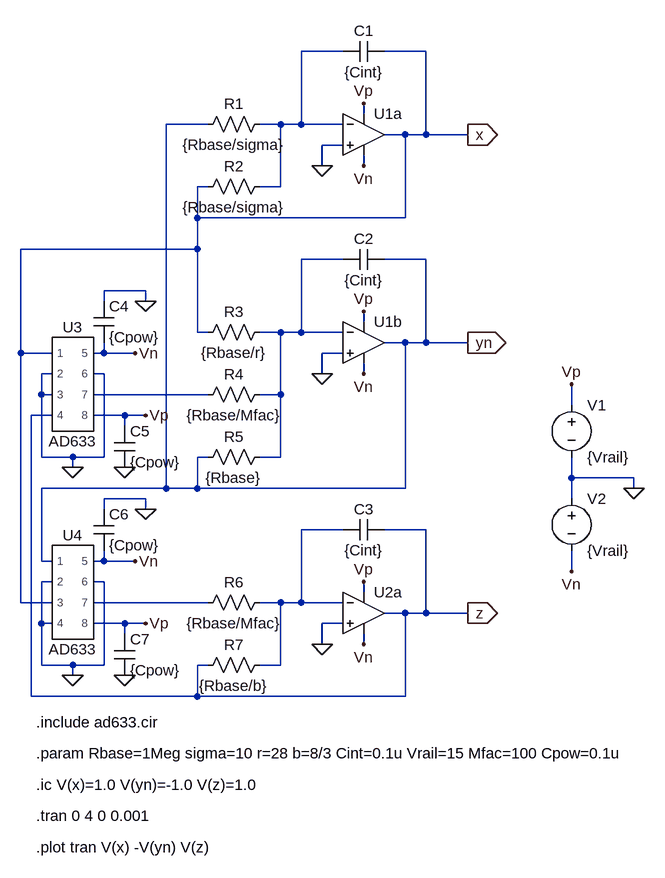
[diagram p0: schematic schematic.asc]
schematic.asc, the LTspice schematic file:
Version 4
SHEET 1 944 1600
WIRE 288 -48 224 -48
WIRE 416 -48 352 -48
WIRE 320 48 320 32
WIRE 80 64 16 64
WIRE 192 64 160 64
WIRE 224 64 224 -48
WIRE 224 64 192 64
WIRE 288 64 224 64
WIRE 384 80 352 80
WIRE 416 80 416 -48
WIRE 416 80 384 80
WIRE 480 80 416 80
WIRE 288 96 256 96
WIRE 256 128 256 96
WIRE 320 128 320 112
WIRE 80 160 64 160
WIRE 192 160 192 64
WIRE 192 160 160 160
WIRE 64 208 64 160
WIRE 384 208 384 80
WIRE 384 208 64 208
WIRE 64 256 64 208
WIRE 64 256 -208 256
WIRE 288 272 224 272
WIRE 416 272 352 272
WIRE -16 320 -80 320
WIRE -80 336 -80 320
WIRE -16 336 -16 320
WIRE 320 368 320 352
WIRE 64 384 64 256
WIRE 80 384 64 384
WIRE 192 384 160 384
WIRE 224 384 224 272
WIRE 224 384 192 384
WIRE 288 384 224 384
WIRE 384 400 352 400
WIRE 416 400 416 272
WIRE 416 400 384 400
WIRE 480 400 416 400
WIRE -208 416 -208 256
WIRE -160 416 -208 416
WIRE -80 416 -80 400
WIRE -80 416 -96 416
WIRE -32 416 -80 416
WIRE 288 416 256 416
WIRE -160 448 -176 448
WIRE -80 448 -96 448
WIRE 256 448 256 416
WIRE 320 448 320 432
WIRE -176 480 -176 448
WIRE -160 480 -176 480
WIRE 80 480 -96 480
WIRE 192 480 192 384
WIRE 192 480 160 480
WIRE 640 496 640 464
WIRE -160 512 -192 512
WIRE -48 512 -96 512
WIRE -16 512 -48 512
WIRE -48 528 -48 512
WIRE -176 576 -176 480
WIRE -128 576 -176 576
WIRE -80 576 -80 448
WIRE -80 576 -128 576
WIRE 80 576 64 576
WIRE 192 576 192 480
WIRE 192 576 160 576
WIRE -128 592 -128 576
WIRE 640 608 640 576
WIRE 736 608 640 608
WIRE 16 624 16 64
WIRE 16 624 -176 624
WIRE 64 624 64 576
WIRE 64 624 16 624
WIRE 384 624 384 400
WIRE 384 624 64 624
WIRE 736 624 736 608
WIRE -16 640 -80 640
WIRE 640 640 640 608
WIRE -80 656 -80 640
WIRE -16 656 -16 640
WIRE 288 688 224 688
WIRE 416 688 352 688
WIRE -176 736 -176 624
WIRE -160 736 -176 736
WIRE -80 736 -80 720
WIRE -80 736 -96 736
WIRE -32 736 -80 736
WIRE 640 752 640 720
WIRE -160 768 -176 768
WIRE -80 768 -96 768
WIRE 320 784 320 768
WIRE -208 800 -208 416
WIRE -160 800 -208 800
WIRE 80 800 -96 800
WIRE 192 800 160 800
WIRE 224 800 224 688
WIRE 224 800 192 800
WIRE 288 800 224 800
WIRE 384 816 352 816
WIRE 416 816 416 688
WIRE 416 816 384 816
WIRE 480 816 416 816
WIRE -176 832 -176 768
WIRE -160 832 -176 832
WIRE -48 832 -96 832
WIRE -16 832 -48 832
WIRE 288 832 256 832
WIRE -48 848 -48 832
WIRE 256 864 256 832
WIRE 320 864 320 848
WIRE -176 896 -176 832
WIRE -128 896 -176 896
WIRE -80 896 -80 768
WIRE -80 896 -128 896
WIRE 80 896 64 896
WIRE 192 896 192 800
WIRE 192 896 160 896
WIRE -128 912 -128 896
WIRE -192 944 -192 512
WIRE 64 944 64 896
WIRE 64 944 -192 944
WIRE 384 944 384 816
WIRE 384 944 64 944
FLAG 736 624 0
FLAG 640 464 Vp
FLAG 640 752 Vn
FLAG 320 32 Vp
FLAG 320 352 Vp
FLAG 320 768 Vp
FLAG 320 864 Vn
FLAG 320 448 Vn
FLAG 320 128 Vn
FLAG 256 448 0
FLAG 256 128 0
FLAG 256 864 0
FLAG 480 80 x
IOPIN 480 80 Out
FLAG 480 400 yn
IOPIN 480 400 Out
FLAG -128 592 0
FLAG -32 416 Vn
FLAG -16 512 Vp
FLAG -128 912 0
FLAG -32 736 Vn
FLAG -16 832 Vp
FLAG 480 816 z
IOPIN 480 816 Out
FLAG -16 656 0
FLAG -48 912 0
FLAG -48 592 0
FLAG -16 336 0
SYMBOL OpAmps/UniversalOpAmp 320 80 R0
SYMATTR InstName U1a
SYMBOL OpAmps/UniversalOpAmp 320 400 R0
SYMATTR InstName U1b
SYMBOL OpAmps/UniversalOpAmp 320 816 R0
SYMATTR InstName U2a
SYMBOL Cap 352 -64 R90
WINDOW 0 0 32 VBottom 2
WINDOW 3 32 32 VTop 2
SYMATTR InstName C1
SYMATTR Value {Cint}
SYMBOL Cap 352 256 R90
WINDOW 0 0 32 VBottom 2
WINDOW 3 32 32 VTop 2
SYMATTR InstName C2
SYMATTR Value {Cint}
SYMBOL Cap 352 672 R90
WINDOW 0 0 32 VBottom 2
WINDOW 3 32 32 VTop 2
SYMATTR InstName C3
SYMATTR Value {Cint}
SYMBOL voltage 640 480 R0
SYMATTR InstName V1
SYMATTR Value {Vrail}
SYMBOL voltage 640 624 R0
SYMATTR InstName V2
SYMATTR Value {Vrail}
SYMBOL Res 176 48 R90
WINDOW 0 0 56 VBottom 2
WINDOW 3 32 56 VTop 2
SYMATTR InstName R1
SYMATTR Value {Rbase/sigma}
SYMBOL Res 176 144 R90
WINDOW 0 0 56 VBottom 2
WINDOW 3 32 56 VTop 2
SYMATTR InstName R2
SYMATTR Value {Rbase/sigma}
SYMBOL Res 176 368 R90
WINDOW 0 0 56 VBottom 2
WINDOW 3 32 56 VTop 2
SYMATTR InstName R3
SYMATTR Value {Rbase/r}
SYMBOL Res 176 464 R90
WINDOW 0 0 56 VBottom 2
WINDOW 3 32 56 VTop 2
SYMATTR InstName R4
SYMATTR Value {Rbase/Mfac}
SYMBOL Res 176 560 R90
WINDOW 0 0 56 VBottom 2
WINDOW 3 32 56 VTop 2
SYMATTR InstName R5
SYMATTR Value {Rbase}
SYMBOL AD633 -128 464 R0
SYMATTR InstName U3
SYMBOL Res 176 784 R90
WINDOW 0 0 56 VBottom 2
WINDOW 3 32 56 VTop 2
SYMATTR InstName R6
SYMATTR Value {Rbase/Mfac}
SYMBOL Res 176 880 R90
WINDOW 0 0 56 VBottom 2
WINDOW 3 32 56 VTop 2
SYMATTR InstName R7
SYMATTR Value {Rbase/b}
SYMBOL AD633 -128 784 R0
SYMATTR InstName U4
SYMBOL Cap -96 336 R0
SYMATTR InstName C4
SYMATTR Value {Cpow}
SYMBOL Cap -64 528 R0
SYMATTR InstName C5
SYMATTR Value {Cpow}
SYMBOL Cap -96 656 R0
SYMATTR InstName C6
SYMATTR Value {Cpow}
SYMBOL Cap -64 848 R0
SYMATTR InstName C7
SYMATTR Value {Cpow}
TEXT -184 984 Left 2 !.include ad633.cir
TEXT -184 1032 Left 2 !.param Rbase=1Meg sigma=10 r=28 b=8/3 Cint=0.1u Vrail=15 Mfac=100 Cpow=0.1u
TEXT -184 1080 Left 2 !.ic V(x)=1.0 V(yn)=-1.0 V(z)=1.0
TEXT -184 1128 Left 2 !.tran 0 4 0 0.001
TEXT -184 1176 Left 2 !.plot tran V(x) -V(yn) V(z)

The netlist it stands for:
* schematic.asc
XU1a 0 N001 Vp Vn x level1 Avol=1Meg GBW=10Meg Vos=0 En=0 Enk=0 In=0 Ink=0 Rin=500Meg  ; pins In+ In- V+ V- OUT
XU1b 0 N002 Vp Vn yn level1 Avol=1Meg GBW=10Meg Vos=0 En=0 Enk=0 In=0 Ink=0 Rin=500Meg  ; pins In+ In- V+ V- OUT
XU2a 0 N004 Vp Vn z level1 Avol=1Meg GBW=10Meg Vos=0 En=0 Enk=0 In=0 Ink=0 Rin=500Meg  ; pins In+ In- V+ V- OUT
C1 x N001 {Cint}
C2 yn N002 {Cint}
C3 z N004 {Cint}
V1 Vp 0 {Vrail}
V2 0 Vn {Vrail}
R1 N001 yn {Rbase/sigma}
R2 N001 x {Rbase/sigma}
R3 N002 x {Rbase/r}
R4 N002 N003 {Rbase/Mfac}
R5 N002 yn {Rbase}
XU3 x 0 0 z Vn 0 N003 Vp AD633  ; pins 1 2 3 4 5 6 7 8
R6 N004 N005 {Rbase/Mfac}
R7 N004 z {Rbase/b}
XU4 yn 0 x 0 Vn 0 N005 Vp AD633  ; pins 1 2 3 4 5 6 7 8
C4 0 Vn {Cpow}
C5 Vp 0 {Cpow}
C6 0 Vn {Cpow}
C7 Vp 0 {Cpow}
.include ad633.cir
.param Rbase=1Meg sigma=10 r=28 b=8/3 Cint=0.1u Vrail=15 Mfac=100 Cpow=0.1u
.ic V(x)=1.0 V(yn)=-1.0 V(z)=1.0
.tran 0 4 0 0.001
.plot tran V(x) -V(yn) V(z)
.lib UniversalOpAmp1.lib
.lib ad633.cir
.backanno
.end